# EAGLE schematic Cooling rev2 - thruhole (EAGLE 7.2.0)
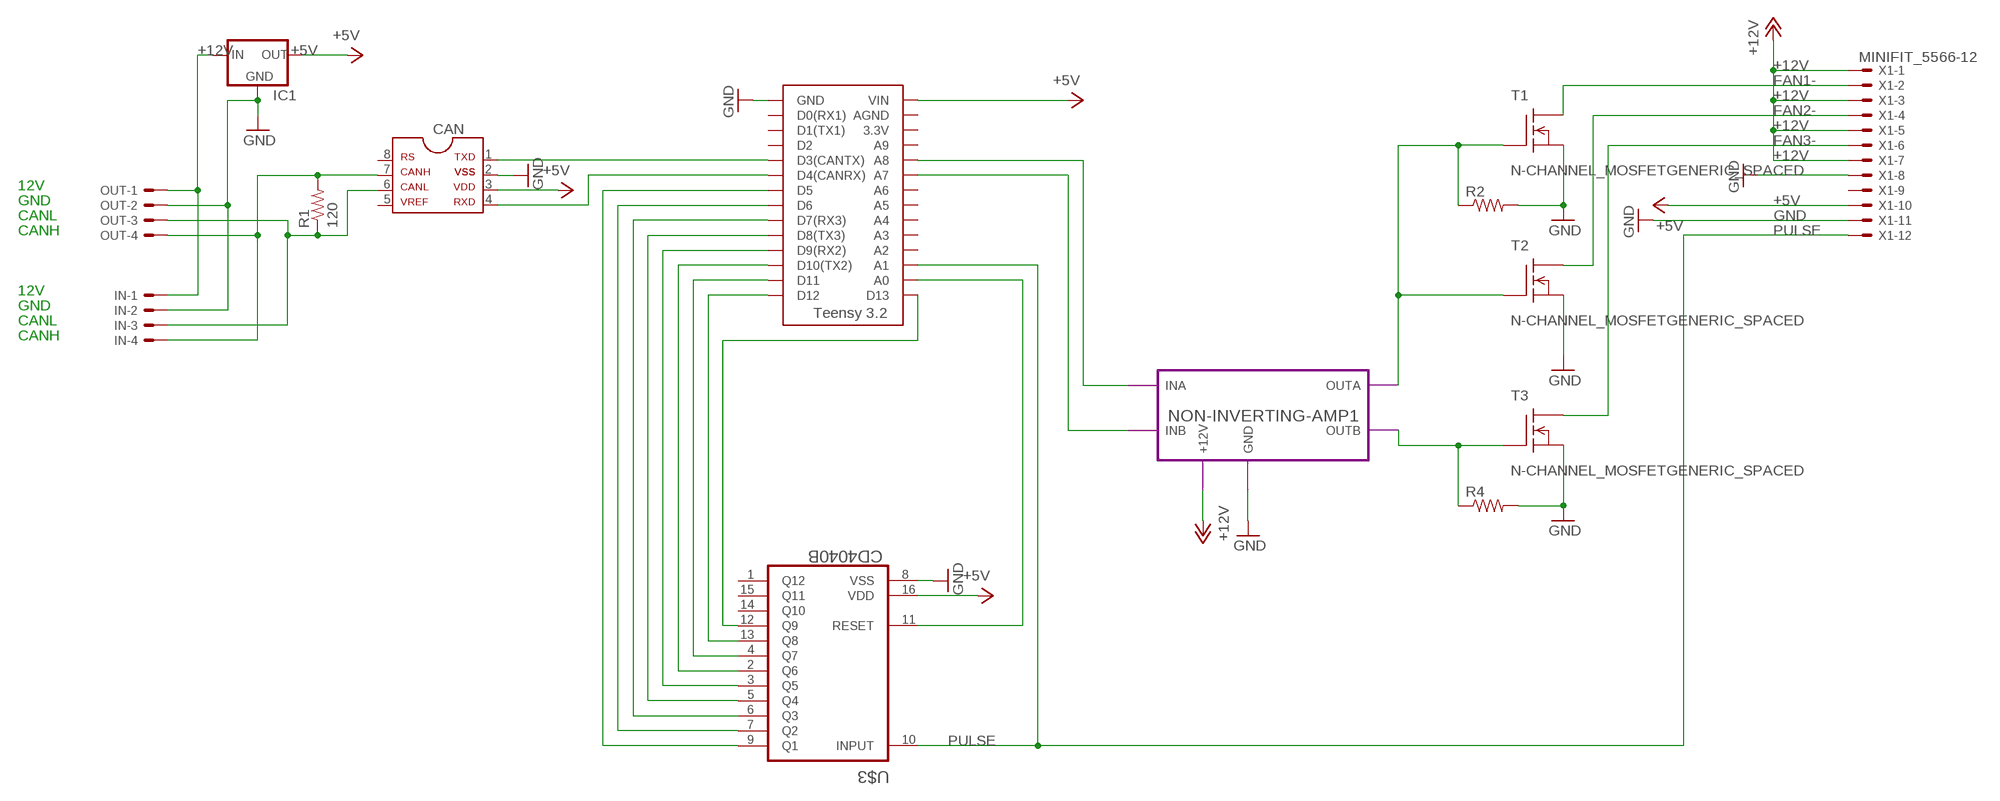
[diagram p0: schematic, sheet 1]

## Parts
CAN  MCP2551DIL  [DIL08]
IC1  5VREG_L7805SPACED  [TO-220-SPACED]
IN  MINIFIT_5566-4  [MINIFIT_5566-4]
OUT  MINIFIT_5566-4  [MINIFIT_5566-4]
R1  120  RESISTOR0805-RES  [0805]
R2  RESISTOR0805-RES  [0805]
R4  RESISTOR0805-RES  [0805]
T1  N-CHANNEL_MOSFETGENERIC_SPACED  [TO-220-SINK-SPACED]
T2  N-CHANNEL_MOSFETGENERIC_SPACED  [TO-220-SINK-SPACED]
T3  N-CHANNEL_MOSFETGENERIC_SPACED  [TO-220-SINK-SPACED]
U$1  TEENSY_3.2_SIMPLE  [TEENSY_3.2_SIMPLE]
U$3  CD4040B  [DIL16]
X1  MINIFIT_5566-12  [MINIFIT_5566-12]

## Module instances
NON-INVERTING-AMP1 = NON-INVERTING-AMP

## Nets
+5V: CAN.3 IC1.3(OUT) U$1.VIN U$3.16(VDD) X1.10
+12V: IC1.1(IN) IN.1 OUT.1 X1.1 X1.3 X1.5 X1.7 ; port NON-INVERTING-AMP1.+12V
FAN1-: T1.2(D) X1.2
FAN2-: T2.2(D) X1.4
FAN3-: T3.2(D) X1.6
GND: CAN.2 IC1.2(GND) IN.2 OUT.2 R2.2 R4.2 T1.3(S) T2.3(S) T3.3(S) U$1.GND U$3.8(VSS) X1.8 X1.11 ; port NON-INVERTING-AMP1.GND
N$1: R2.1 T1.1(G) T2.1(G) ; port NON-INVERTING-AMP1.OUTA
N$2: CAN.1 U$1.D3(CANTX)
N$3: CAN.4 U$1.D4(CANRX)
N$4: U$1.A8 ; port NON-INVERTING-AMP1.INA
N$5: CAN.6
N$6: R4.1 T3.1(G) ; port NON-INVERTING-AMP1.OUTB
N$8: IN.3 OUT.3 R1.1
N$11: CAN.7 IN.4 OUT.4 R1.2
N$12: U$1.D5 U$3.9(Q1)
N$13: U$1.D6 U$3.7(Q2)
N$14: U$1.D7(RX3) U$3.6(Q3)
N$15: U$1.D8(TX3) U$3.5(Q4)
N$16: U$1.D9(RX2) U$3.3(Q5)
N$17: U$1.D10(TX2) U$3.2(Q6)
N$20: U$1.A7 ; port NON-INVERTING-AMP1.INB
N$21: U$1.D11 U$3.4(Q7)
N$22: U$1.D12 U$3.13(Q8)
N$23: U$1.A0 U$3.11(RESET)
N$24: U$1.D13 U$3.12(Q9)
PULSE: U$1.A1 U$3.10(INPUT) X1.12
Unconnected: CAN.5 CAN.8 U$1.3.3V U$1.A2 U$1.A3 U$1.A4 U$1.A5 U$1.A6 U$1.A9 U$1.AGND U$1.D0(RX1) U$1.D1(TX1) U$1.D2 U$3.1(Q12) U$3.14(Q10) U$3.15(Q11) X1.9

## Notes on the sheet
- 12V
- GND
- CANL
- CANH
- 12V
- GND
- CANL
- CANH

## Library data of the parts
CAN = HyTechDevices:MCP2551: MCP2551 High-Speed CAN Transceiver Product Webpage <https://www.microchip.com/wwwproducts/en/MCP2551> Datasheet <http://ww1.microchip.com/downloads/en/DeviceDoc/21667f.pdf> This device is outdated It is replaced by MCP2561. Comparison Page <https://www.microchip.com/wwwproducts/ProductCompare/MCP2551/MCP2561> Product Webpage <https://www.microchip.com/wwwproducts/en/MCP2561> Datasheet <http://ww1.microchip.com/downloads/en/DeviceDoc/20005167C.pdf>
IC1 = HyTechDevices:5VREG_L7805: Voltage Regulator Switching 5v regulator Datasheet <http://power.murata.com/data/power/oki-78sr.pdf> Standard 7805 5V regulator. IGO (Input Ground Output). Spark Fun Electronics SKU : COM-00107 Datasheet <http://www.mouser.com/ds/2/308/MC7800-D-94905.pdf>
IN OUT = HyTechDevices:MINIFIT_5566-4: Mini-Fit Junior connector 4 pole Source: http://www.molex.com; OC_FARNELL: unknown; OC_NEWARK: unknown
R1 R2 R4 = HyTechDevices:RESISTOR: Resistor Basic schematic elements and footprints for 0603, 1206, and PTH resistors.
T1-T3 = HyTechDevices:N-CHANNEL_MOSFET: Generic N-Channel MOSFET
U$1 = HyTechDevices:TEENSY_3.2_SIMPLE: Simple version of the Teensy 3.2 board that only uses the 2 main rows of pins, not the inner pins or the pins opposite the usb port.
U$3 = HyTechDevices:CD4040B: Texas Instruments CD4040B 12-Stage Binary Counter/Divider CMOS Ripple-Carry 12-Stage Binary Counter/Divider
X1 = HyTechDevices:MINIFIT_5566-12: Mini-Fit Junior connector 12 pole Source: http://www.molex.com; OC_FARNELL: unknown; OC_NEWARK: unknown

## Module NON-INVERTING-AMP
Ports: INA(in) INB(in) OUTA(out) OUTB(out) GND(pwr) +12V(pwr)
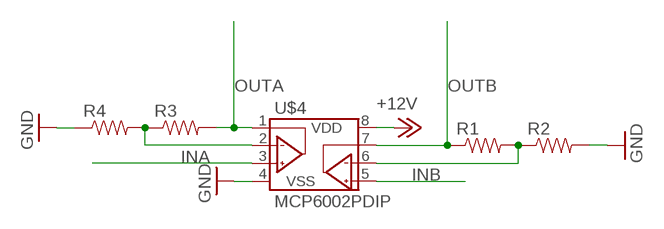
[diagram p1: schematic, module NON-INVERTING-AMP, sheet 1]

### Parts
R1  RESISTOR0805-RES  [0805]
R2  RESISTOR0805-RES  [0805]
R3  RESISTOR0805-RES  [0805]
R4  RESISTOR0805-RES  [0805]
U$4  MCP6002PDIP  [DIL08]

### Nets
+12V: U$4.8(VDD)
GND: R2.2 R4.1 U$4.4(VSS)
INA: U$4.3(VINA+)
INB: U$4.5(VINB+)
N$2: R1.2 R2.1 U$4.6(VINB-)
N$4: R3.1 R4.2 U$4.2(VINA-)
OUTA: R3.2 U$4.1(VOUTA)
OUTB: R1.1 U$4.7(VOUTB)

### Library data of the parts
R1-R4 = HyTechDevices:RESISTOR: Resistor Basic schematic elements and footprints for 0603, 1206, and PTH resistors.
U$4 = HyTechDevices:MCP6002: Microchip MCP6002 Dual Channel Op Amp

## Net classes
0 default: width 0.406 mm, drill 0.762 mm, clearance 0.813 mm